# Altium project EDP_Hydrolink.PrjPcb
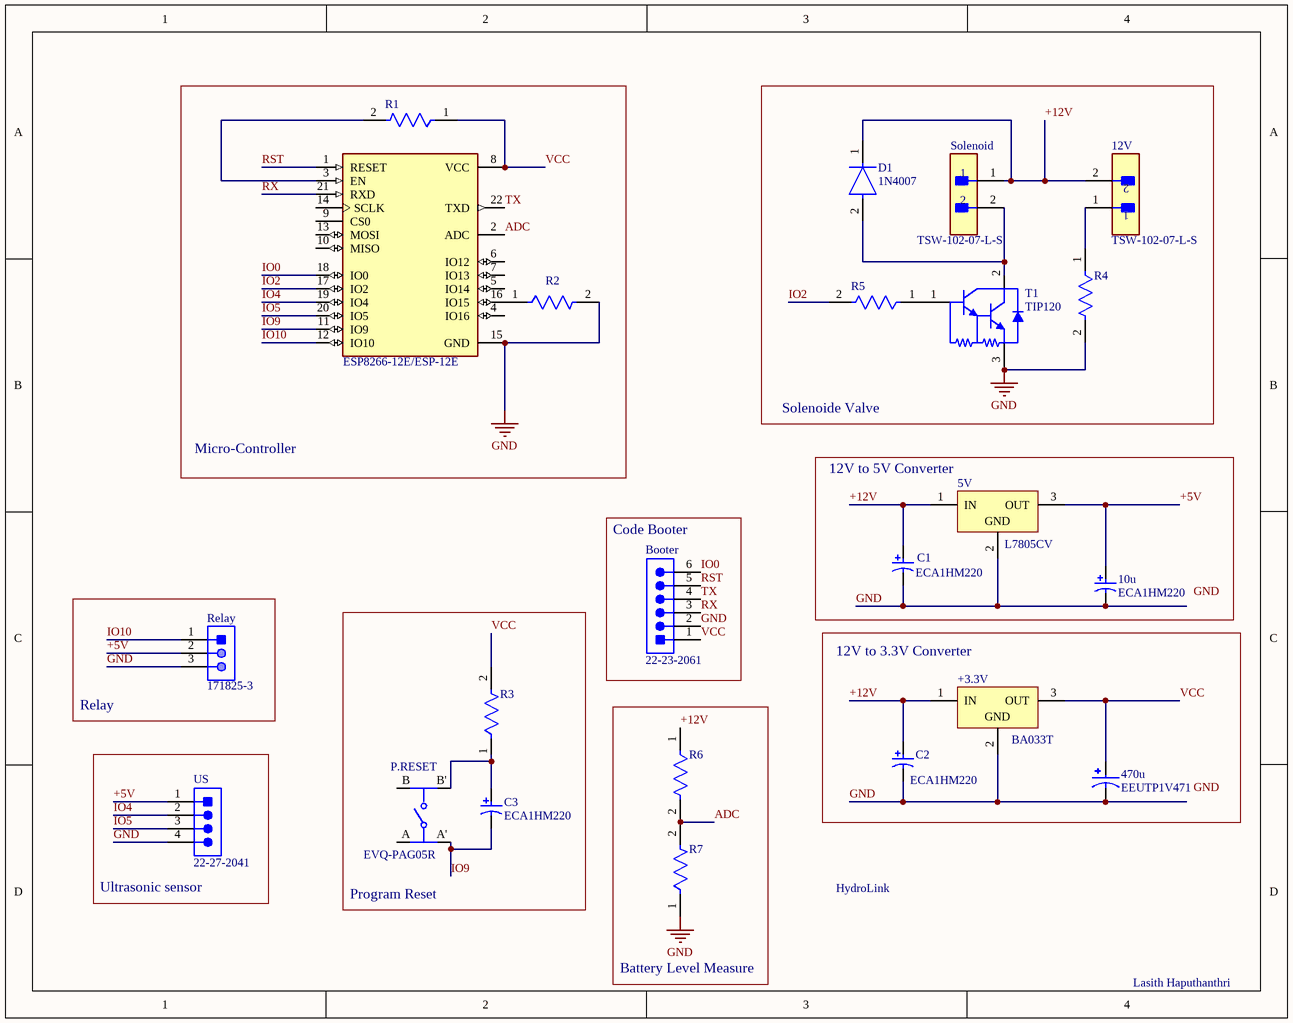
[diagram p0: Hydro Line.SchDoc]
1 sheet, 23 parts. Net scope: global (net labels, ports and power ports of the same name join across sheets).
Board file: PCB1.PcbDoc

## Sheet Hydro Line.SchDoc
size A; SheetNumber: 1; SheetTotal: 1

### Parts
5V  L7805CV  [TO220]
10u  ECA1HM220  [CAPPR55-200-1100X500X1200]
12V  TSW-102-07-L-S  [FP-TSW-102-07-L-S-MFG]
470u  EEUTP1V471  [CAPPRD500W60D1250H2000]
+3.3V  BA033T  [TO220]
Booter  22-23-2061  [MOLX-22-23-2061_V]
C1  ECA1HM220  [CAPPR55-200-1100X500X1200]
C2  ECA1HM220  [CAPPR55-200-1100X500X1200]
C3  ECA1HM220  [CAPPR55-200-1100X500X1200]
D1  1N4007  [FP-1N4007-MFG]
P.RESET  EVQ-PAG05R  [FP-EVQ-PAG05R-MFG]
R1  (no value)  [FP-MBB0207-MFG]
R2  (no value)  [FP-MBB0207-MFG]
R3  (no value)  [FP-MBB0207-MFG]
R4  (no value)  [FP-MBB0207-MFG]
R5  (no value)  [FP-MBB0207-MFG]
R6  (no value)  [FP-MBB0207-MFG]
R7  (no value)  [FP-MBB0207-MFG]
Relay  171825-3  [TECO-171825-3_V]
Solenoid  TSW-102-07-L-S  [FP-TSW-102-07-L-S-MFG]
T1  TIP120  [ONSC-TO-220-3-221A-09]
US  22-27-2041  [MOLX-22-27-2041_V]
  ESP8266-12E/ESP-12E  [XCVR_ESP8266-12E/ESP-12E]

### Blocks framed on the sheet
Micro-Controller: R1 R2 
Solenoide Valve: 12V D1 R4 R5 Solenoid T1
12V to 5V Converter: 5V 10u C1
Code Booter: Booter
Relay: Relay
Program Reset: C3 P.RESET R3
12V to 3.3V Converter: 470u +3.3V C2
Battery Level Measure: R6 R7
Ultrasonic sensor: US

### Nets
GND: 5V.2(GND) 10u.2 470u.N +3.3V.2(GND) Booter.2 C1.2 C2.2 R2.2 R4.2 R7.1 Relay.3 T1.3(E) US.4 .15(GND)
+5V: 5V.3(OUT) 10u.1 Relay.2 US.1
+12V: 5V.1(IN) 12V.2 +3.3V.1(IN) C1.1 C2.1 D1.1(C) R6.1 Solenoid.1
ADC: R6.2 R7.2 .2(ADC)
IO0: Booter.6 .18(IO0)
IO2: R5.2 .17(IO2)
IO4: US.2 .19(IO4)
IO5: US.3 .20(IO5)
IO9: C3.2 P.RESET.A' .11(IO9)
IO10: Relay.1 .12(IO10)
RST: Booter.5 .1(RESET)
RX: Booter.3 .21(RXD)
TX: Booter.4 .22(TXD)
VCC: 470u.P +3.3V.3(OUT) Booter.1 R1.1 R3.2 .8(VCC)
Net12V_1: 12V.1 R4.1
NetC3_1: C3.1 P.RESET.B' R3.1
NetD1_2: D1.2(A) Solenoid.2 T1.2(C)
NetR1_2: R1.2 .3(EN)
NetR2_1: R2.1 .16(IO15)
NetR5_1: R5.1 T1.1(B)

Not connected (* = marked no-connect by the designer): P.RESET A B;  4(IO16) 5(IO14) 6(IO12) 7(IO13) 9(CS0) 10(MISO) 13(MOSI) 14(SCLK)

### Notes on the sheet
- HydroLink
- Lasith Haputhanthri
- Labels drawn without touching a wire or pin: GND

### Library data of the parts
5V +3.3V = CMP-0244-00483-1: Positive Voltage Regulator, 5V, 3-Pin TO-220; PackageDescription: TO, Thru-Hole, Vertical, Heatsink Mounted; 3 In-Line Leads; Pitch 2.54 mm; ComponentLink2Description: Datasheet; PackageReference: TO220; ComponentLink3URL: http://www.st.com/internet/com/TECHNICAL_RESOURCES/TECHNICAL_LITERATURE/PACKAGE_INFORMATION/CD00004649.pdf; DatasheetVersion: 16/11/2011; ComponentLink1Description: Manufacturer URL; ComponentLink1URL: http://www.st.com; PackageVersion: ver3.0; ComponentLink3Description: Package Specification; ComponentLink2URL: http://www.st.com/internet/com/TECHNICAL_RESOURCES/TECHNICAL_LITERATURE/DATASHEET/CD00000444.pdf
10u C1-C3 = CMP-1665-00036-2: Aluminum Electrolytic Capacitor, 22 uF, +/- 20%, 50 V, -40 to 85 degC, 2-Pin THD, RoHS, Bulk; Manufacturer: Panasonic; Ripple Current: 100mA; Life (Hours): 2000Hour; Voltage: 50V; Dissipation Factor: 0.12%; Leakage Current: 3uA; Lead/Base Style: Straight; Capacitance: 22uF; Lead Diameter: 0.5mm; Max Operating Temperature: 85degC; Height: 11mm; Package Reference: CAPPR55-200-1100X500X1200; Radiation Hardening: No; RoHSCompliant: true; Termination: Radial; Case/Package: Radial; REACH SVHC: NoSVHC; Height - Seated (Max): 0.472inch; Min Operating Temperature: -40degC; Packaging: Bulk; Manufacturer URL: http://www.panasonic.com/; Length: 11mm; Tolerance: 20%; Voltage Rating: 50V; Voltage Rating (DC): 50V; Datasheet URL: https://industrial.panasonic.com/cdbs/www-data/pdf/RDF0000/ABA0000C1218.pdf; Lead Pitch: 2mm; Ripple Current (AC): 100mA; Package Description: 2-Pin Radial Lead, Dia 5 mm, Height 12 mm; Diameter: 5mm; Datasheet Version: Rev. 05, 10/2016; Package Quantity: 200; Mount: ThroughHole
12V Solenoid = CMP-02766-001428-1: CONN HEADER VERT 2POS 2.54MM; Voltage Rating: 550V; Current Rating: 7.6A; Gender: Male; Number of Contacts: 2; Connector Type: Male Pin; Radiation Hardening: No; Orientation: Straight; Contact Plating: Gold; Max Operating Temperature: 125°C; Mount: Through Hole; Package Quantity: 1; Number of Rows: 1; Housing Material: Polyester; RoHS Compliant: Yes; Length: 5.08mm; Max Voltage Rating (AC): 550V; Pitch: 2.54mm; Packaging: Bulk; Depth: 2.54mm; Termination: Solder; Min Operating Temperature: -55°C; Housing Color: Black; Lead Free: Lead Free; Color: Black; Number of Positions: 2; Width: 2.54mm; Max Current Rating: 7.6A; REACH SVHC: No SVHC; Contact Material: Bronze; Contact Mating Length: 0.23inch; Series: TSW; Contact Type: Male Pin
470u = EEUTP1V471: CAP ALUM 470UF 20% 35V RADIAL; MP: EEU-TP1V471; MF: Panasonic; Package: RADIAL-2 Panasonic; Price: None; Availability: In Stock; Value: *; Check_prices: https://www.snapeda.com/parts/EEU-TP1V471/Panasonic/view-part/2304886/?ref=eda; SnapEDA_Link: https://www.snapeda.com/parts/EEU-TP1V471/Panasonic/view-part/2304886/?ref=snap
Booter = CMP-2000-05536-1: Male Header, Pitch 2.54 mm, 1 x 6 Position, Height 10.67 mm, Tail Length 3.56 mm, 0 to 70 degC, RoHS, Bulk; Manufacturer: Molex; Pitch: 2.54mm; Mounting Angle: Vertical; Current Rating: 4A; Number of Positions / Contacts: 6; Voltage Rating: 250V; Packaging: Bulk; Package Description: Male Header, Pitch 2.54 mm, 1 x 6 Position, Height 10.67 mm, Tail Length 3.56 mm; Number of Rows: 1; Type: PinStrip; Contact Material: Brass; Product Category: .100K.K.Connectors; Factory Pack Quantity: 1000; Mounting Style: ThroughHole; RoHS: Details; Contact Plating: Tin; Housing Material: Nylon; Mounting Technology: ThroughHole; Termination Style: ThroughHole; Tradename: KK; Number of Positions: 6; Brand: Molex; Product Type: Headers; Series: 6373; Datasheet URL: https://datasheet.ciiva.com/19460/232303-19460895.pdf; Package Reference: 22-23-2061; Datasheet Version: Rev. P, 09/2001; Manufacturer URL: http://www.molex.com/
D1 = CMP-123542-000001-1: Rectifier diode 1000 V 1 A DO-41, ,; Manufacturer: Diotec; Max Surge Forward Current: 27A; Forward Current: 1A; Max Junction Temp: +175°C; Reverse Voltage: 1000V; Value: 15pF; Peak Reverse Current: 5uA; Category: Diode; Temperature Range Low: -50°C; Automotive: No; Temperature: -50°C to +175°C; Lead Free: Yes; ComponentLink2Description: Datasheet; Max Repetitive Reverse Voltage: 1000V; ComponentLink2URL: https://datasheet.octopart.com/1N4007-Diotec-datasheet-62346875.pdf; Manufacturer Part Number: 1N4007; Device Class L3: Rectifier Diodes; Height: 2.8mm; Octopart: https://octopart.com/1n4007-diotec-4040411; Package: 1N4007; Temperature Range High: +175°C; Device Class L1: Discrete Semiconductors; Device Class L2: Diodes; RoHS: TRUE; Capacitance: 15pF; Ipc Land Pattern Name: DIOAD888W100L520D280
P.RESET = CMP-05618-000039-1: SWITCH TACTILE SPST-NO 0.02A 15V; Electrical Life: 50000Cycles; Actuator Color: Red; Switch Function: Off-Mom; Actuator Type: Standard; Max Current Rating: 20mA; Contact Resistance: 50mR; Operating Force: 2.6N; Switch Travel: 0.25mm; Illumination Type: Non-Illuminated; Throw Configuration: SPST; Actuator Length: 1.6mm; Max Operating Temperature: 70°C; Mount: Through Hole; RoHS Compliant: Yes; Depth: 6.5mm; Radiation Hardening: No; Orientation: Straight; Width: 6mm; REACH SVHC: No SVHC; Voltage Rating (DC): 15V; Package Quantity: 500; Size: 6mm; Max Voltage Rating (DC): 15V; Mechanical Life: 50000Cycles; Contact Current Rating: 20mA; Contact Plating: Silver; Lead Free: Lead Free; Series: EVQPA; Height: 5mm; Length: 6mm; Min Operating Temperature: -20°C; Current Rating: 20mA; Termination: PC Pin; Packaging: Bulk
R1-R7 = CMP-02408-000035-1: RES 10K OHM 0.6W 1% AXIAL; Voltage Rating: 300V; Resistance: 10kR; Max Power Dissipation: 600mW; Temperature Coefficient: 50ppm/°C; Radiation Hardening: No; Case/Package: Conformal; Termination: Axial; Military Standard: Not; Length: 6.5mm; Voltage Rating (DC): 300V; RoHS Compliant: Yes; Number of Terminations: 2; Packaging: Tape and Reel; Features: Automotive AEC-Q200; Tolerance: 1%; Min Operating Temperature: -55°C; Power Rating: 600mW; Lead Free: Lead Free; Resistor Type: Metal Film; Construction: Cylindrical; Series: MBB 0207 - Professional; Max Operating Temperature: 155°C; Diameter: 2.5mm; Resistance Tolerance: 1%; Contact Plating: Tin; Technology: THIN FILM
Relay = CMP-2000-07494-1: Male Header, Pitch 2.5 mm, 1 x 3 Position, Height 10.4 mm, Tail Length 3.6 mm, / -20 to 95 degC / , RoHS, Bulk; Manufacturer: TE Connectivity; Mating Alignment: Yes(With); Tail Length: 0.142inch; Mating Post Length: 7.5mm; PCB Thickness: 0.063inch; PCB Mount Alignment: No(Without); Voltage Rating: 350V; Max Voltage Rating (AC): 250V; Plating Thickness: 0.8um; PCB Mounting Orientation: Vertical; Number of Positions: 3; PCB Mount Retention: Without; Max Current Rating: 3.5A; Max Voltage Rating (DC): 350.25kV; Pitch: 2.5mm; Approvals: UL; Contact Resistance: 20mOhm; Mount: ThroughHole; Length: 7.5mm; Orientation: Straight; Contact Mating Length: 0.295inch; Contact Material: Brass; Housing Material: Nylon; Package Description: Male Header, Pitch 2.5 mm, 1 x 3 Position, Height 10.4 mm, Tail Length 3.6 mm; Colour: Natural; Backwall/Post Interruptions: No(Without); Min Operating Temperature: -20degC; Mating Retention: Yes(With); Connector Type: Header; Packaging: Bag; RoHSCompliant: True; Package Reference: 171825-3; Contact Shape: Square; Strain Relief: No(Without); Contact Gender: Male; Number of Contacts: 3; Manufacturer URL: http://www.te.com/; Height: 0.409inch; Contact Retention: No(Without); Datasheet Version: Rev. Y3, 12/2016; Panel Mount Retention: No(Without); Datasheet URL: http://www.te.com/commerce/DocumentDelivery/DDEController?Action=showdoc&DocId=Customer+Drawing%7F171825%7FY3%7Fpdf%7FEnglish%7FENG_CD_171825_Y3.pdf%7F171825-3; Termination: Solder; Mounting Technology: ThroughHole; Max Operating Temperature: 95degC; Flammability Rating: UL94V-0; REACH SVHC: NoSVHC; Housing Colour: Natural; Package Quantity: 1000; Number of Rows: 1; Depth: 4.9mm; Contact Plating: Tin
T1 = CMP-1047-00140-1: Plastic Medium-Power, Complementary Silicon Transistor, 3-Pin TO-220, Tube; Manufacturer: On Semiconductor; IC Continuous (A): 5; Polarity: NPN; ComponentLink2URL: http://www.onsemi.cn/pub_link/Collateral/TIP120-D.PDF; Packing: Tube; PartNumber: TIP120; ComponentLink3Description: Package Specification; PackageDescription: 3-Pin Flange Mount, Vertical Straight Lead, Body 9.97 x 4.445 mm, Pitch 2.54 mm; Mounting Technology: Through Hole; ComponentLink1URL: http://www.onsemi.com/; PackageVersion: Rev. AG, 09/2011; ComponentLink1Description: Manufacturer URL; PackageReference: TO-220-3-221A-09; ComponentLink2Description: Datasheet; RoHS: FALSE; DatasheetVersion: Rev. 8; ComponentLink3URL: http://www.onsemi.com/pub_link/Collateral/221A-09.PDF
US = CMP-2000-05243-1: Male Header, Pitch 2.54 mm, 1 x 4 Position, Height 11.7 mm, Tail Length 3.56 mm, RoHS, Bulk; Manufacturer: Molex; Voltage rating: 250V; Current rating: 4A; Datasheet Version: Rev. F, 06/2009; Operating temperature: 0degCto+75degC; Contact material: Tinplatedbrass; Manufacturer URL: http://www.molex.com/; Housing material: Nylon(UL94V-0); Datasheet URL: http://www.molex.com/pdm_docs/sd/022272041_sd.pdf
 = ESP8266-12E/ESP-12E: This WiFi module has a 32-bit MCU micro and clock speeds supporting 80 MHz or 160 MHz. Supports the RTOS and integrated Wi-Fi MAC/BB/RF/PA/LNA, and has an on-board antenna.; MF: AI-Thinker